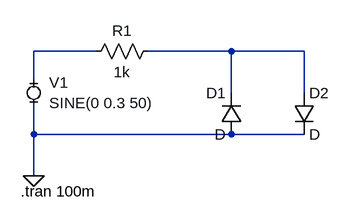
[diagram p0: schematic Draft4.asc]
Draft4.asc, the LTspice schematic file:
Version 4
SHEET 1 880 680
WIRE 192 112 96 112
WIRE 400 112 272 112
WIRE 512 112 400 112
WIRE 96 160 96 112
WIRE 400 176 400 112
WIRE 512 176 512 112
WIRE 96 240 96 192
WIRE 400 240 96 240
WIRE 512 240 400 240
WIRE 96 304 96 240
FLAG 96 304 0
SYMBOL MiniSyms4\\voltage- 96 176 R0
WINDOW 123 0 0 Left 2
WINDOW 39 0 0 Left 2
SYMATTR InstName V1
SYMATTR Value SINE(0 0.3 50)
SYMBOL res 288 96 R90
WINDOW 0 0 56 VBottom 2
WINDOW 3 32 56 VTop 2
SYMATTR InstName R1
SYMATTR Value 1k
SYMBOL diode 416 240 R180
WINDOW 0 24 64 Left 2
WINDOW 3 24 0 Left 2
SYMATTR InstName D1
SYMBOL diode 496 176 R0
SYMATTR InstName D2
TEXT 76 328 Left 2 !.tran 100m

The netlist it stands for:
* Draft4.asc
V1 N001 0 SINE(0 0.3 50)
R1 N002 N001 1k
D1 0 N002 D
D2 N002 0 D
.model D D
.lib standard.dio
.tran 100m
.backanno
.end